# EAGLE schematic MRDT0001A1 (EAGLE 6.2)

## Sheet 1 of 2
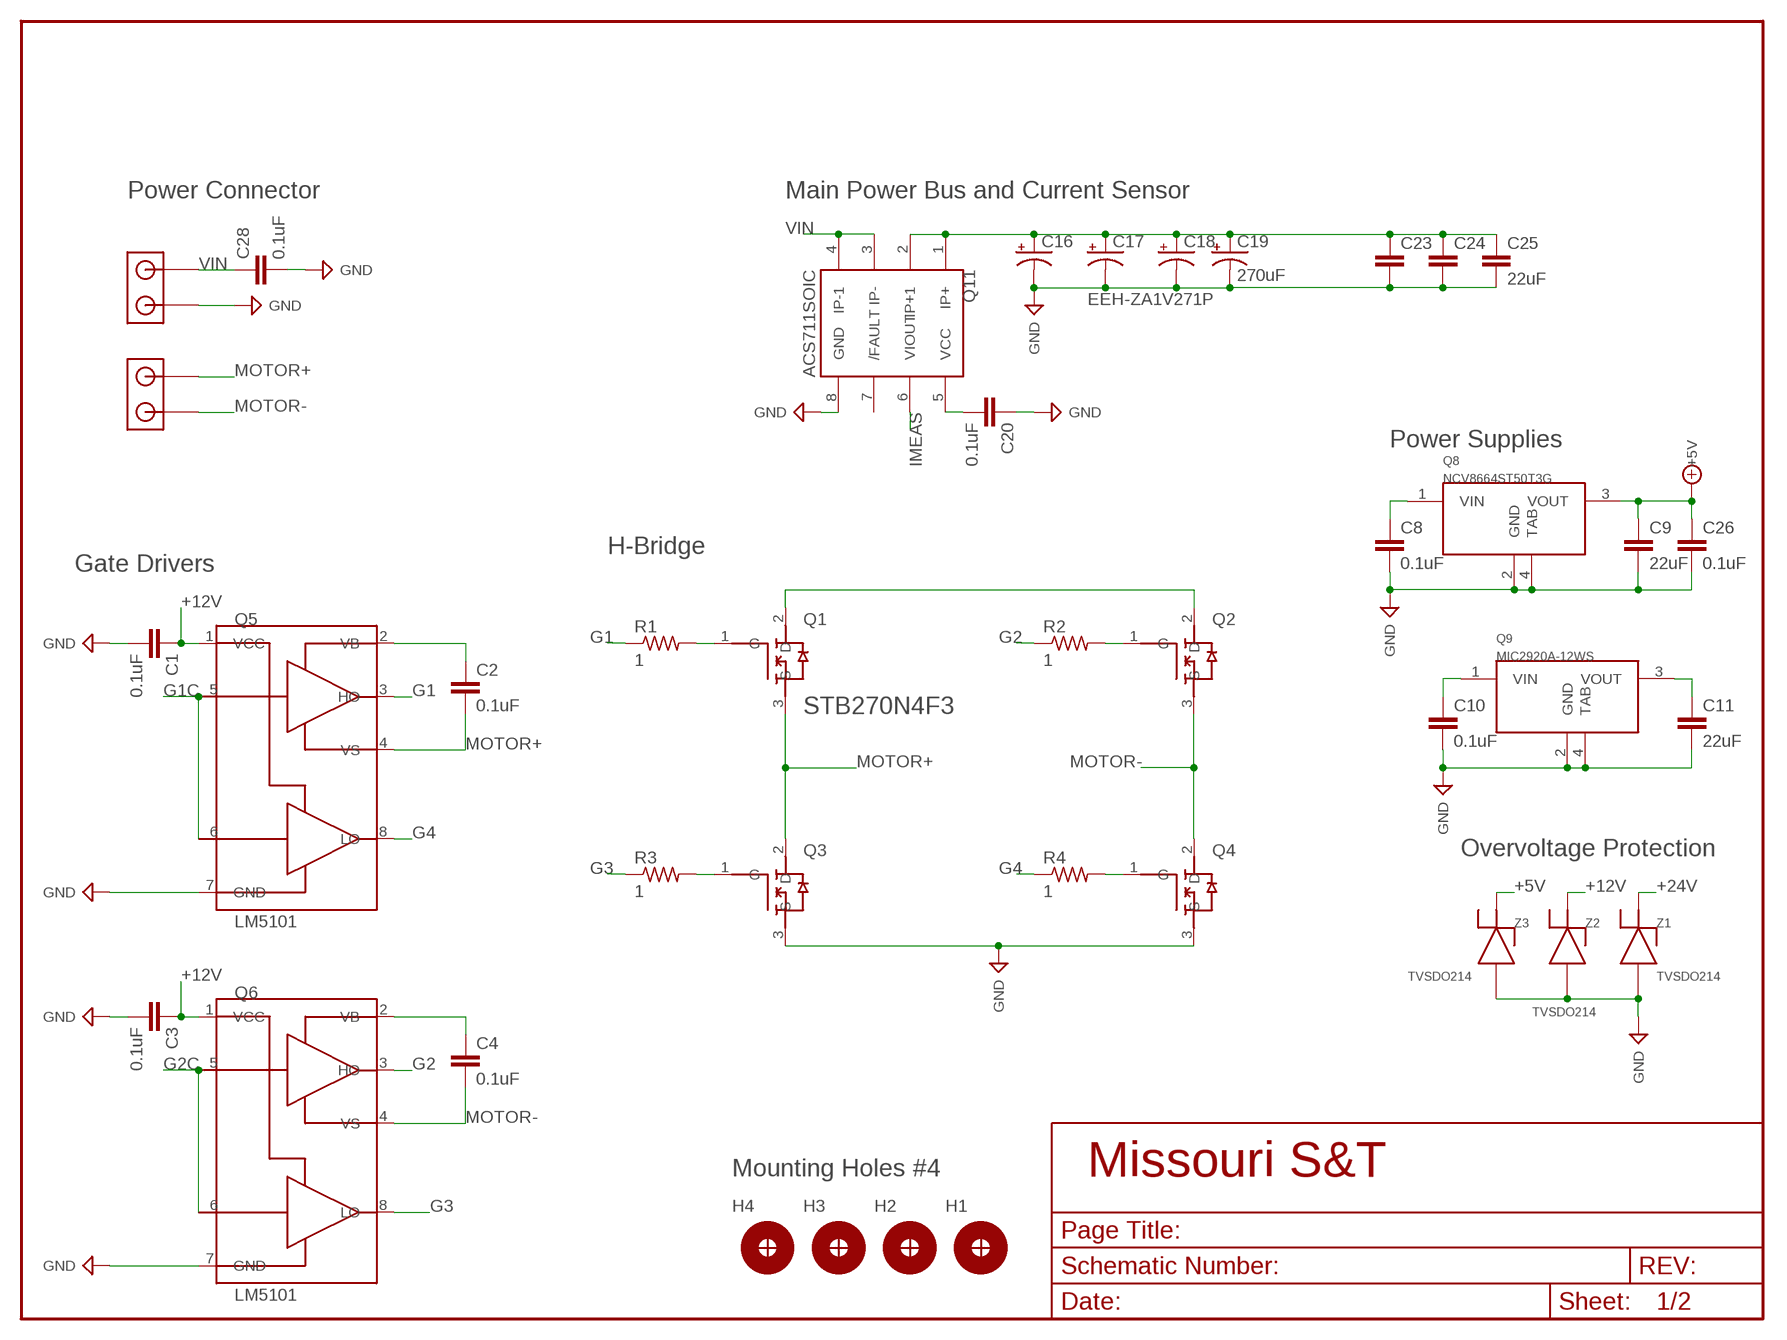
[diagram p0: schematic, sheet 1]

### Parts
C1  0.1uF  C_CAP_0805  [C_0805]
C2  0.1uF  C_CAP_1206  [C_1206]
C3  0.1uF  C_CAP_0805  [C_0805]
C4  0.1uF  C_CAP_1206  [C_1206]
C8  0.1uF  C_CAP_1206  [C_1206]
C9  22uF  C_CAP_1206  [C_1206]
C10  0.1uF  C_CAP_1206  [C_1206]
C11  22uF  C_CAP_1206  [C_1206]
C16  CAP_POL10MMSM  [C_10MMSM]
C17  CAP_POL10MMSM  [C_10MMSM]
C18  CAP_POL10MMSM  [C_10MMSM]
C19  270uF  CAP_POL10MMSM  [C_10MMSM]
C20  0.1uF  C_CAP_1206  [C_1206]
C23  C_CAP_1206  [C_1206]
C24  C_CAP_1206  [C_1206]
C25  22uF  C_CAP_1206  [C_1206]
C26  0.1uF  C_CAP_1206  [C_1206]
C28  0.1uF  C_CAP_0805  [C_0805]
H1  H_MNTHOLE_#4  [H_MNTHOLE_#4]
H2  H_MNTHOLE_#4  [H_MNTHOLE_#4]
H3  H_MNTHOLE_#4  [H_MNTHOLE_#4]
H4  H_MNTHOLE_#4  [H_MNTHOLE_#4]
J4  J_1546074-2  [THERM_BLOCK_2]
J5  J_1546074-2  [THERM_BLOCK_2]
Q1  N-CH-MOSFETTO263  [TO-263]
Q2  N-CH-MOSFETTO263  [TO-263]
Q3  N-CH-MOSFETTO263  [TO-263]
Q4  N-CH-MOSFETTO263  [TO-263]
Q5  LM5101  LM5101SOIC8  [SOIC8]
Q6  LM5101  LM5101SOIC8  [SOIC8]
Q8  NCV8664ST50T3G  LDO-4PINSOT223  [SOT-223]
Q9  MIC2920A-12WS  LDO-4PINSOT223  [SOT-223]
Q11  ACS711SOIC  [SOIC8]
R1  1  R_RES_0805  [R_0805]
R2  1  R_RES_0805  [R_0805]
R3  1  R_RES_0805  [R_0805]
R4  1  R_RES_0805  [R_0805]
Z1  TVSDO214  Z_TVSDO214  [DO-214AC]
Z2  TVSDO214  Z_TVSDO214  [DO-214AC]
Z3  TVSDO214  Z_TVSDO214  [DO-214AC]

### Nets
+5V: C9.1 C26.1 Q8.3(VOUT) Z3.C ; supply symbol labelled SUP_+5V ; also sheet 2
+12V: C1.1 C3.1 C11.1 Q5.1(VCC) Q6.1(VCC) Q9.3(VOUT) Z2.C
+24V: C10.1 C16.+ C17.+ C18.+ C19.+ C23.1 C24.1 C25.1 Q1.2(D) Q2.2(D) Q9.1(VIN) Q11.1(IP+) Q11.2(IP+1) Z1.C ; also sheet 2
G1: Q5.3(HO) R1.1
G1C: Q5.5(HI) Q5.6(LI) ; also sheet 2
G2: Q6.3(HO) R2.1
G2C: Q6.5(HI) Q6.6(LI) ; also sheet 2
G3: Q6.8(LO) R3.1
G4: Q5.8(LO) R4.1
GND: C1.2 C3.2 C8.2 C9.2 C10.2 C11.2 C16.- C17.- C18.- C19.- C20.1 C23.2 C24.2 C25.2 C26.2 C28.2 J4.P$1 Q3.3(S) Q4.3(S) Q5.7(GND) Q6.7(GND) Q8.2(GND) Q8.4(TAB) Q9.2(GND) Q9.4(TAB) Q11.8(GND) Z1.A Z2.A Z3.A ; supply symbol labelled SUP_GND ; also sheet 2
IMEAS: Q11.6(VIOUT) ; also sheet 2
MOTOR+: C2.2 J5.P$2 Q1.3(S) Q3.2(D) Q5.4(VS)
MOTOR-: C4.2 J5.P$1 Q2.3(S) Q4.2(D) Q6.4(VS)
N$1: Q1.1(G) R1.2
N$2: Q3.1(G) R3.2
N$3: Q2.1(G) R2.2
N$4: Q4.1(G) R4.2
N$9: C2.1 Q5.2(VB)
N$11: C4.1 Q6.2(VB)
N$12: C20.2 Q11.5(VCC)
VIN: C8.1 C28.1 J4.P$2 Q8.1(VIN) Q11.3(IP-) Q11.4(IP-1)
Unconnected: H1.1 H2.1 H3.1 H4.1 Q11.7(/FAULT)

### Notes on the sheet
- Power Connector | Main Power Bus and Current Sensor
- EEH-ZA1V271P
- Power Supplies
- H-Bridge
- Gate Drivers
- STB270N4F3
- Overvoltage Protection
- Mounting Holes #4

## Sheet 2 of 2
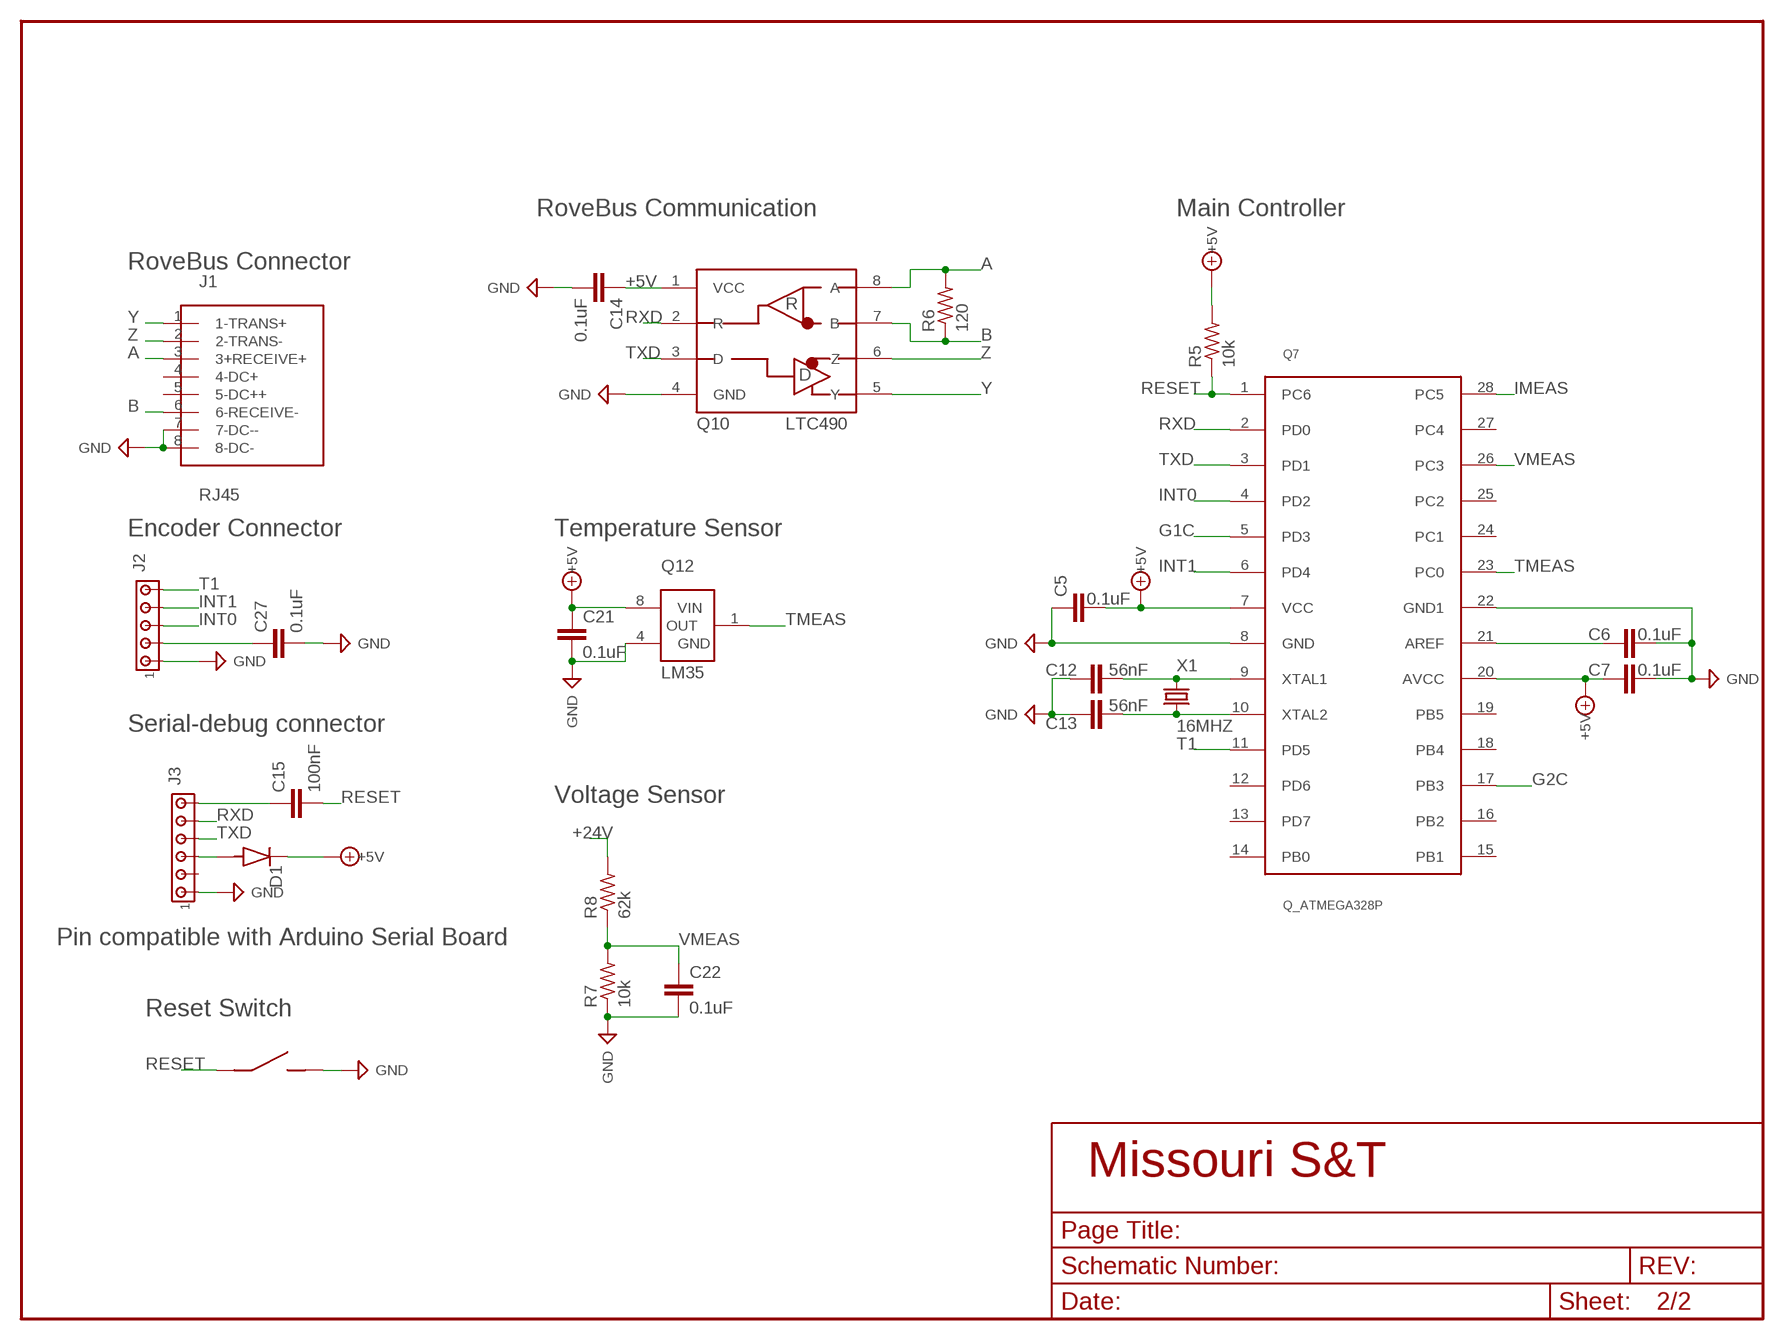
[diagram p1: schematic, sheet 2]

### Parts
C5  0.1uF  C_CAP_0805  [C_0805]
C6  0.1uF  C_CAP_0805  [C_0805]
C7  0.1uF  C_CAP_0805  [C_0805]
C12  56nF  C_CAP_1206  [C_1206]
C13  56nF  C_CAP_1206  [C_1206]
C14  0.1uF  C_CAP_0805  [C_0805]
C15  100nF  C_CAP_0805  [C_0805]
C21  0.1uF  C_CAP_0805  [C_0805]
C22  0.1uF  C_CAP_0805  [C_0805]
C27  0.1uF  C_CAP_0805  [C_0805]
D1  D_DIODEDO214AC  [DO-214AC]
J1  RJ45  [RJ45-CAT5E]
J2  J_MTA5P_100  [J_MTA100_5P]
J3  J_MTA6P_100  [J_MTA100_6P]
J6  J_MC32857  [J_TOGGLE]
Q7  Q_ATMEGA328P  [DIP28]
Q10  LTC490  RS485FULL  [SOIC8]
Q12  LM35  Q_LM35SOIC8  [SOIC8]
R5  10k  R_RES_0805  [R_0805]
R6  120  R_RES_0805  [R_0805]
R7  10k  R_RES_0805  [R_0805]
R8  62k  R_RES_0805  [R_0805]
X1  16MHZ  X_HC49SCRYSTALTH  [HC-49]

### Nets
+5V: C5.2 C7.1 C14.1 C21.1 C27.1 D1.C J2.2 Q7.7(VCC) Q7.20(AVCC) Q10.1(VCC) Q12.8(VIN) R5.2 ; supply symbol labelled SUP_+5V ; also sheet 1
+24V: R8.2 ; also sheet 1
A: J1.3(3+RECEIVE+) Q10.8(A) R6.2
B: J1.6(6-RECEIVE-) Q10.7(B) R6.1
EXTRESET: C15.1 J3.6
G1C: Q7.5(PD3) ; also sheet 1
G2C: Q7.17(PB3) ; also sheet 1
GND: C5.1 C6.2 C7.2 C12.1 C13.1 C14.2 C21.2 C22.2 C27.2 J1.7(7-DC--) J1.8(8-DC-) J2.1 J3.1 J6.P$2 Q7.8(GND) Q7.22(GND1) Q10.4(GND) Q12.4(GND) R7.1 ; supply symbol labelled SUP_GND ; also sheet 1
IMEAS: Q7.28(PC5) ; also sheet 1
INT0: J2.3 Q7.4(PD2)
INT1: J2.4 Q7.6(PD4)
N$5: C12.2 Q7.9(XTAL1) X1.P$1
N$6: C6.1 Q7.21(AREF)
N$7: D1.A J3.3
N$14: C13.2 Q7.10(XTAL2) X1.P$2
RESET: C15.2 J6.P$1 Q7.1(PC6) R5.1
RXD: J3.5 Q7.2(PD0) Q10.2(R)
T1: J2.5 Q7.11(PD5)
TMEAS: Q7.23(PC0) Q12.1(OUT)
TXD: J3.4 Q7.3(PD1) Q10.3(D)
VMEAS: C22.1 Q7.26(PC3) R7.2 R8.1
Y: J1.1(1-TRANS+) Q10.5(Y)
Z: J1.2(2-TRANS-) Q10.6(Z)
Unconnected: J1.4(4-DC+) J1.5(5-DC++) J3.2 Q7.12(PD6) Q7.13(PD7) Q7.14(PB0) Q7.15(PB1) Q7.16(PB2) Q7.18(PB4) Q7.19(PB5) Q7.24(PC1) Q7.25(PC2) Q7.27(PC4)

### Notes on the sheet
- RoveBus Communication | Main Controller
- RoveBus Connector
- Encoder Connector | Temperature Sensor
- Serial-debug connector
- Voltage Sensor
- Pin compatible with Arduino Serial Board
- Reset Switch

## Library data of the parts
C1-C15 C20-C22 C26-C28 = Master:C_CAP
C16-C19 = Master:CAP_POL: Generic Polarized Capacitor
C23-C25 = Lib_Passive:C_CAP
D1 = Master:D_DIODE: Standard Diode Package
H1-H4 = Lib_TH:H_MNTHOLE
J1 = Master:RJ45
J2 = Lib_TH:J_MTA5P
J3 = Lib_TH:J_MTA6P
J4 J5 = Master:J_1546074-2
J6 = Master:J_MC32857: SWITCH, TACTILE, SPST-NO, 50mA, THD
Q1-Q4 = Master:N-CH-MOSFET: Generic N-CH MOSFET
Q5 Q6 = Master:LM5101: IC DVR HALF-BRIDGE HV 8-SOIC 120V 3A/2A/1A for A/B/C respectively
Q7 = Master:Q_ATMEGA328P: ATMEGA 328P in 28PIN PDIP package
Q8 Q9 = Master:LDO-4PIN: Standard 4pin LDO
Q10 = Master:RS485FULL: Generic Full-Duplex RS485 Transciever, compatible with ADM485x series and MAX308x
Q11 = Master:ACS711: Hall Effect Current Sensor
Q12 = Master:Q_LM35: IC, TEMPERATURE SENSOR, 0.4°C, TO-92-3
R1-R8 = Master:R_RES
X1 = Master:X_HC49SCRYSTAL: CRYSTAL METAL CAN, 16MHZ, 18PF, HC-49/US
Z1-Z3 = Master:Z_TVS: Generic TVS Diode